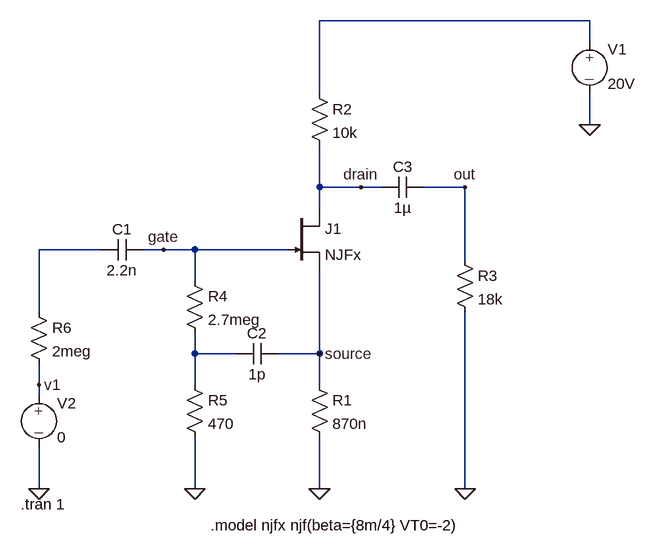
[diagram p0: schematic JFET_verstarker.asc]
JFET_verstarker.asc, the LTspice schematic file:
Version 4
SHEET 1 880 680
WIRE 608 -176 192 -176
WIRE 608 -144 608 -176
WIRE 192 -64 192 -176
WIRE 608 -16 608 -64
WIRE 192 80 192 16
WIRE 256 80 192 80
WIRE 288 80 256 80
WIRE 416 80 352 80
WIRE 192 112 192 80
WIRE -144 176 -240 176
WIRE -48 176 -80 176
WIRE 0 176 -48 176
WIRE 144 176 0 176
WIRE 416 192 416 80
WIRE 0 224 0 176
WIRE -240 272 -240 176
WIRE 0 336 0 304
WIRE 64 336 0 336
WIRE 192 336 192 208
WIRE 192 336 128 336
WIRE -240 384 -240 352
WIRE 0 384 0 336
WIRE 192 384 192 336
WIRE -240 400 -240 384
WIRE -240 544 -240 480
WIRE 0 544 0 464
WIRE 192 544 192 464
WIRE 416 544 416 272
FLAG -240 544 0
FLAG 0 544 0
FLAG 192 544 0
FLAG 416 544 0
FLAG 608 -16 0
FLAG 416 80 out
FLAG 256 80 drain
FLAG 192 336 source
FLAG -48 176 gate
FLAG -240 384 v1
SYMBOL EIT_Semiconductors\\njf 144 112 R0
SYMATTR InstName J1
SYMATTR Value NJFx
SYMBOL res 176 368 R0
SYMATTR InstName R1
SYMATTR Value 870n
SYMBOL res 176 -80 R0
SYMATTR InstName R2
SYMATTR Value 10k
SYMBOL res 400 176 R0
SYMATTR InstName R3
SYMATTR Value 18k
SYMBOL res -16 208 R0
SYMATTR InstName R4
SYMATTR Value 2.7meg
SYMBOL res -16 368 R0
SYMATTR InstName R5
SYMATTR Value 470
SYMBOL res -256 256 R0
SYMATTR InstName R6
SYMATTR Value 2meg
SYMBOL cap -144 192 R270
WINDOW 0 32 32 VTop 0
WINDOW 3 0 32 VBottom 0
SYMATTR InstName C1
SYMATTR Value 2.2n
SYMBOL cap 64 352 R270
WINDOW 0 32 32 VTop 0
WINDOW 3 0 32 VBottom 0
SYMATTR InstName C2
SYMATTR Value 1p
SYMBOL cap 288 96 R270
WINDOW 0 32 32 VTop 0
WINDOW 3 0 32 VBottom 0
SYMATTR InstName C3
SYMATTR Value 1µ
SYMBOL source-V 608 -160 R0
WINDOW 123 0 0 Left 0
WINDOW 39 0 0 Left 0
SYMATTR InstName V1
SYMATTR Value 20V
SYMBOL source-V -240 384 R0
WINDOW 123 0 0 Left 0
WINDOW 39 0 0 Left 0
SYMATTR InstName V2
SYMATTR Value 0
TEXT -268 568 Left 0 !.tran 1
TEXT 24 600 Left 0 !.model njfx njf(beta={8m/4} VT0=-2)

The netlist it stands for:
* JFET_verstarker.asc
J1 drain gate source NJFx
R1 source 0 870n
R2 N001 drain 10k
R3 out 0 18k
R4 gate N003 2.7meg
R5 N003 0 470
R6 N002 v1 2meg
C1 N002 gate 2.2n
C2 N003 source 1p
C3 drain out 1µ
V1 N001 0 20V
V2 v1 0 0
.model NJF NJF
.model PJF PJF
.lib standard.jft
.tran 1
.model njfx njf(beta={8m/4} VT0=-2)
.backanno
.end